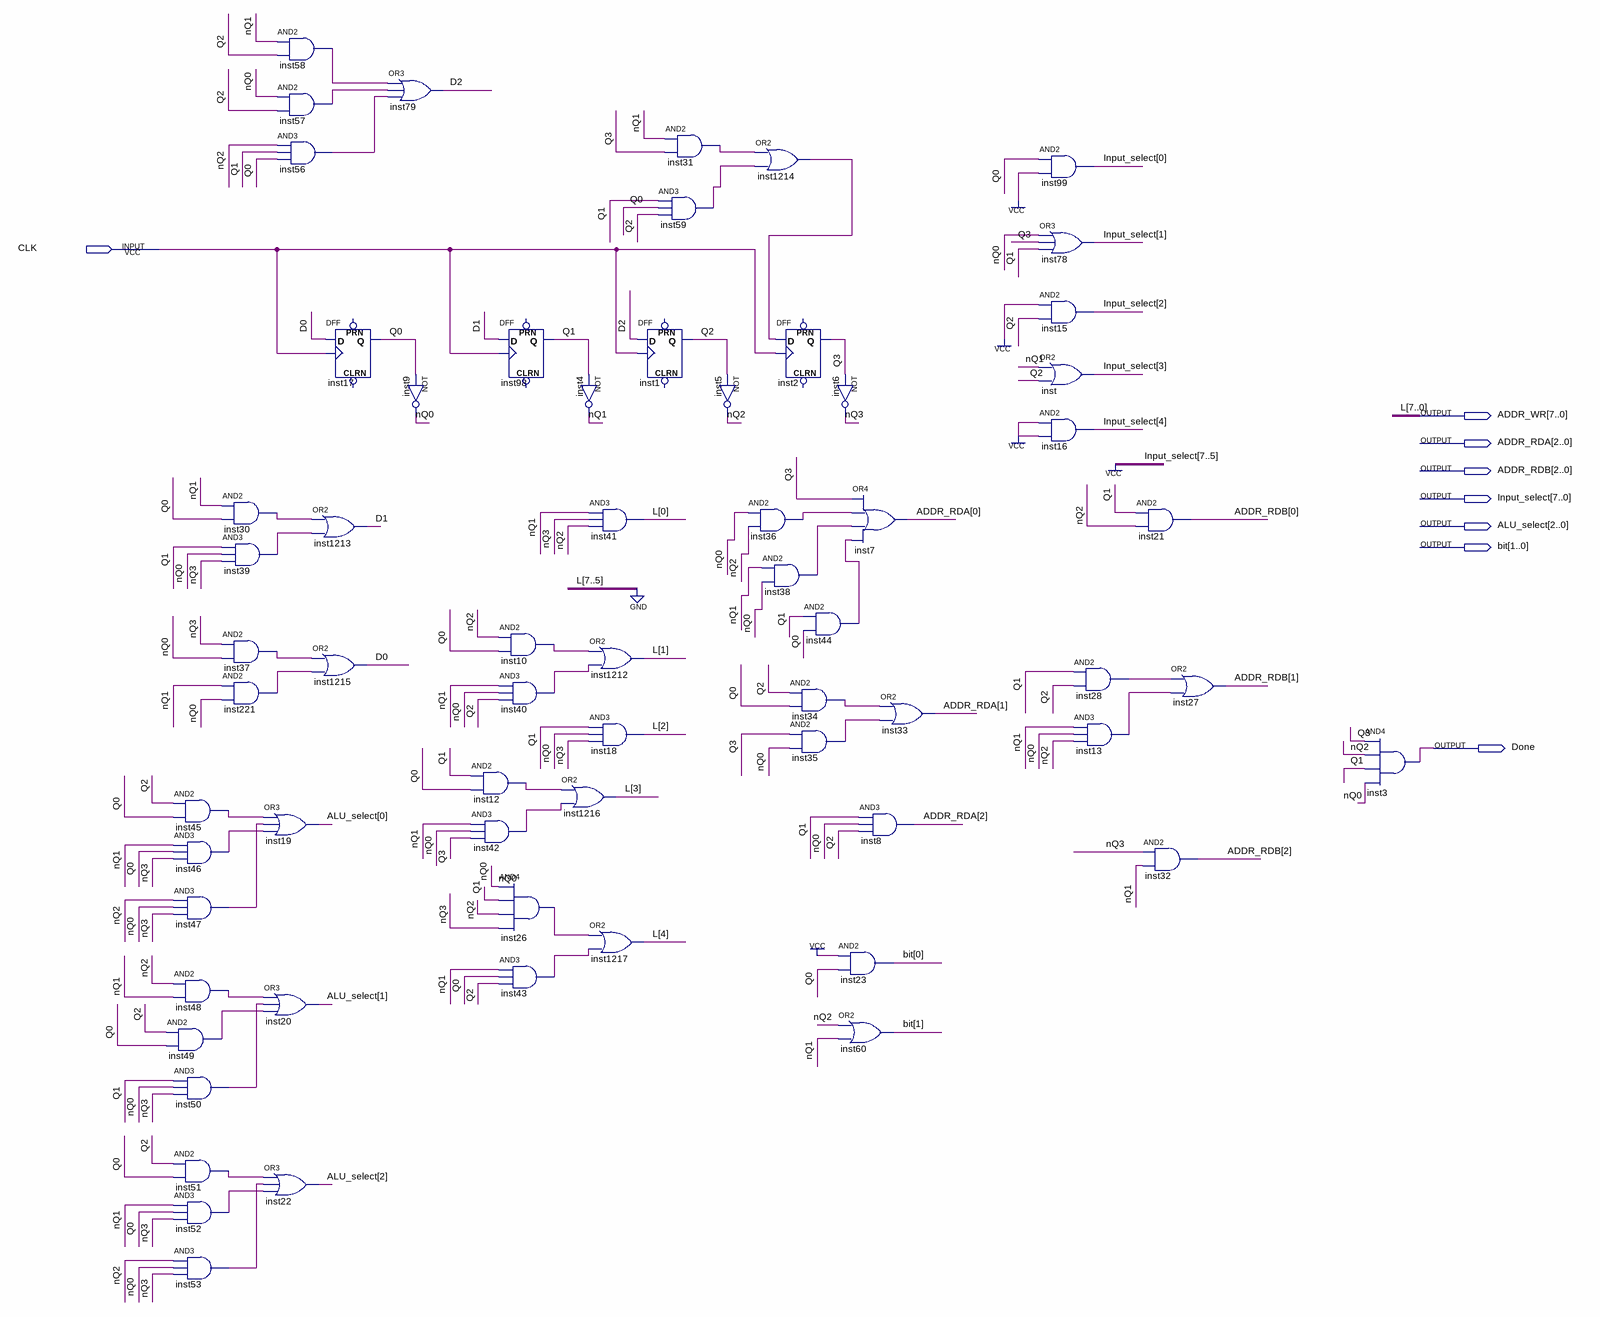
[diagram p0: schematic sheet]
// Quartus schematic ControlUnit.bdf as structural Verilog: 65 symbols, 8 pins
module ControlUnit (
  input  CLK,
  output [7:0] ADDR_WR,
  output [2:0] ADDR_RDA,
  output [2:0] ADDR_RDB,
  output [7:0] Input_select,
  output [2:0] ALU_select,
  output [1:0] \bit ,
  output Done
);

  wire D0, D1, D2, inst10_out, inst12_out, inst13_out, inst26_out, inst28_out, inst30_out, inst31_out,
       inst34_out, inst35_out, inst36_out, inst37_out, inst38_out, inst39_out, inst40_out, inst42_out,
       inst43_out, inst44_out, inst45_out, inst46_out, inst47_out, inst48_out, inst49_out, inst50_out,
       inst51_out, inst52_out, inst53_out, inst56_out, inst57_out, inst58_out, inst59_out, inst221_out,
       inst1214_out, nQ0, nQ1, nQ2, nQ3, Q0, Q1, Q2, Q3;

  and inst45 (inst45_out, Q2, Q0);
  and inst46 (inst46_out, nQ1, Q0, nQ3);
  and inst47 (inst47_out, nQ2, nQ0, nQ3);
  and inst48 (inst48_out, nQ2, nQ1);
  and inst49 (inst49_out, Q2, Q0);
  and inst50 (inst50_out, Q1, nQ0, nQ3);
  and inst51 (inst51_out, Q2, Q0);
  and inst52 (inst52_out, nQ1, Q0, nQ3);
  and inst53 (inst53_out, nQ2, nQ0, nQ3);
  and inst30 (inst30_out, nQ1, Q0);
  and inst39 (inst39_out, Q1, nQ0, nQ3);
  and inst37 (inst37_out, nQ3, nQ0);
  and inst221 (inst221_out, nQ1, nQ0);
  or inst19 (ALU_select[0], inst45_out, inst47_out, inst46_out);
  or inst20 (ALU_select[1], inst48_out, inst50_out, inst49_out);
  or inst22 (ALU_select[2], inst51_out, inst53_out, inst52_out);
  and inst58 (inst58_out, nQ1, Q2);
  and inst57 (inst57_out, nQ0, Q2);
  and inst56 (inst56_out, nQ2, Q1, Q0);
  or inst1213 (D1, inst30_out, inst39_out);
  or inst1215 (D0, inst37_out, inst221_out);
  DFF inst17 (.CLK(CLK), .D(D0), .Q(Q0));  // open: CLRN, PRN
  or inst79 (D2, inst58_out, inst57_out, inst56_out);
  not inst9 (nQ0, Q0);
  and inst12 (inst12_out, Q1, Q0);
  and inst42 (inst42_out, nQ1, nQ0, Q3);
  DFF inst98 (.CLK(CLK), .D(D1), .Q(Q1));  // open: CLRN, PRN
  and inst10 (inst10_out, nQ2, Q0);
  and inst40 (inst40_out, nQ1, nQ0, Q2);
  and inst26 (inst26_out, nQ0, Q1, nQ2, nQ3);
  and inst43 (inst43_out, nQ1, Q0, Q2);
  not inst4 (nQ1, Q1);
  and inst41 (ADDR_WR[0], nQ1, nQ3, nQ2);
  or inst1212 (ADDR_WR[1], inst10_out, inst40_out);
  and inst18 (ADDR_WR[2], Q1, nQ0, nQ3);
  or inst1216 (ADDR_WR[3], inst12_out, inst42_out);
  or inst1217 (ADDR_WR[4], inst26_out, inst43_out);
  DFF inst1 (.CLK(CLK), .D(D2), .Q(Q2));  // open: CLRN, PRN
  and inst31 (inst31_out, nQ1, Q3);
  and inst59 (inst59_out, Q1, Q0, Q2);
  or inst1214 (inst1214_out, inst31_out, inst59_out);
  not inst5 (nQ2, Q2);
  and inst36 (inst36_out, nQ0, nQ2);
  and inst38 (inst38_out, nQ1, nQ0);
  DFF inst2 (.CLK(CLK), .D(inst1214_out), .Q(Q3));  // open: CLRN, PRN
  and inst44 (inst44_out, Q1, Q0);
  and inst34 (inst34_out, Q2, Q0);
  and inst35 (inst35_out, Q3, nQ0);
  not inst6 (nQ3, Q3);
  or inst7 (ADDR_RDA[0], Q3, inst36_out, inst38_out, inst44_out);
  and inst8 (ADDR_RDA[2], Q1, nQ0, Q2);
  and inst23 (\bit [0], 1'b1, Q0);
  or inst60 (\bit [1], nQ2, nQ1);
  or inst33 (ADDR_RDA[1], inst34_out, inst35_out);
  and inst99 (Input_select[0], Q0, 1'b1);
  or inst78 (Input_select[1], nQ0, Q3, Q1);
  and inst15 (Input_select[2], 1'b1, Q2);
  or inst (Input_select[3], nQ1, Q2);
  and inst16 (Input_select[4], 1'b1, 1'b1);
  and inst28 (inst28_out, Q1, Q2);
  and inst13 (inst13_out, nQ1, nQ0, nQ2);
  and inst21 (ADDR_RDB[0], Q1, nQ2);
  and inst32 (ADDR_RDB[2], nQ3, nQ1);
  or inst27 (ADDR_RDB[1], inst28_out, inst13_out);
  and inst3 (Done, Q3, nQ2, Q1, nQ0);

  assign ADDR_WR[7:5] = 3'b000;
  assign Input_select[7:5] = 3'b111;

  // Other names for the same wires on the sheet: L[4:0] = ADDR_WR[4:0]
endmodule
